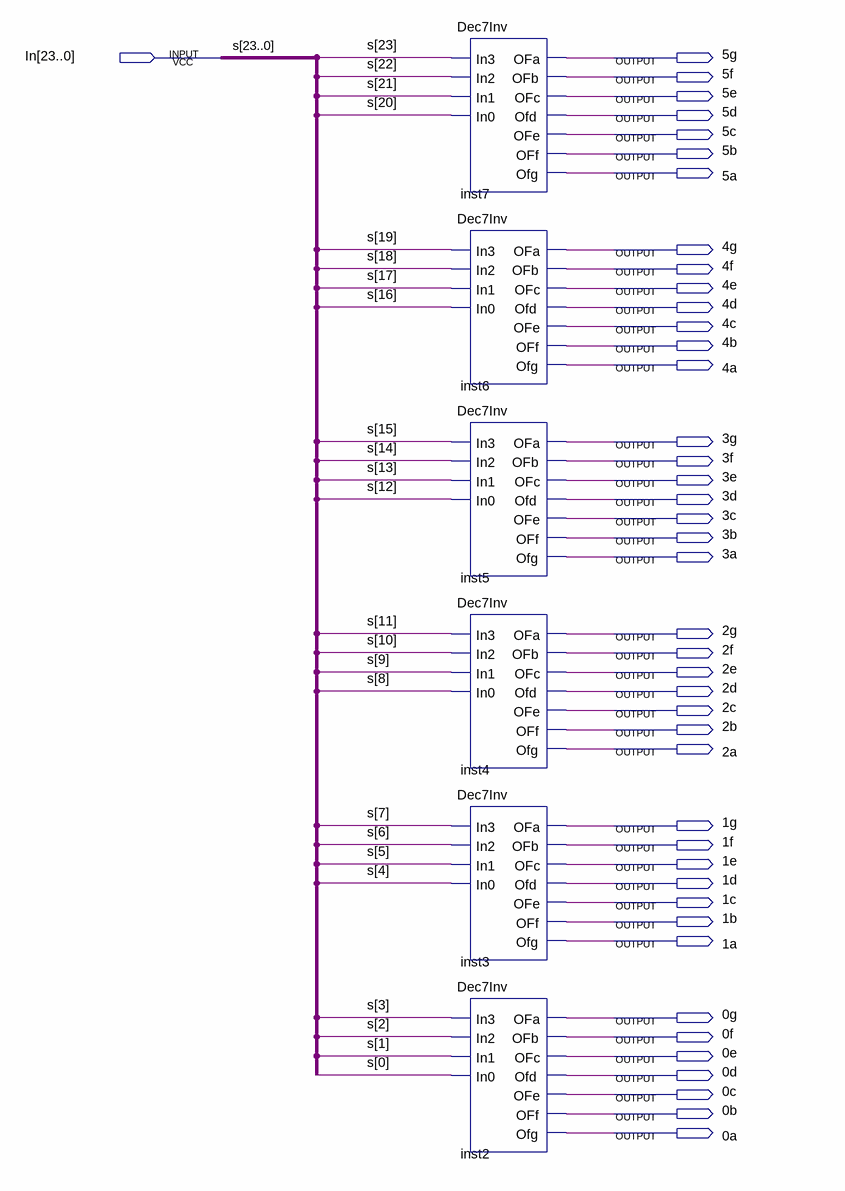
[diagram p0: schematic sheet]
// Quartus schematic Hex_0_5.bdf as structural Verilog: 6 symbols, 43 pins
module Hex_0_5 (
  input  [23:0] In,
  output \5g ,
  output \5f ,
  output \5e ,
  output \5d ,
  output \5c ,
  output \5b ,
  output \5a ,
  output \4g ,
  output \4f ,
  output \4e ,
  output \4d ,
  output \4c ,
  output \4b ,
  output \4a ,
  output \3g ,
  output \3f ,
  output \3e ,
  output \3d ,
  output \3c ,
  output \3b ,
  output \3a ,
  output \2g ,
  output \2f ,
  output \2e ,
  output \2d ,
  output \2c ,
  output \2b ,
  output \2a ,
  output \1g ,
  output \1f ,
  output \1e ,
  output \1d ,
  output \1c ,
  output \1b ,
  output \1a ,
  output \0g ,
  output \0f ,
  output \0e ,
  output \0d ,
  output \0c ,
  output \0b ,
  output \0a 
);

  Dec7Inv inst7 (
    .In3(In[23]), .In2(In[22]), .In1(In[21]), .In0(In[20]), .OFa(\5g ), .OFb(\5f ), .OFc(\5e ), .Ofd(\5d ),
    .OFe(\5c ), .OFf(\5b ), .Ofg(\5a ));
  Dec7Inv inst6 (
    .In3(In[19]), .In2(In[18]), .In1(In[17]), .In0(In[16]), .OFa(\4g ), .OFb(\4f ), .OFc(\4e ), .Ofd(\4d ),
    .OFe(\4c ), .OFf(\4b ), .Ofg(\4a ));
  Dec7Inv inst5 (
    .In3(In[15]), .In2(In[14]), .In1(In[13]), .In0(In[12]), .OFa(\3g ), .OFb(\3f ), .OFc(\3e ), .Ofd(\3d ),
    .OFe(\3c ), .OFf(\3b ), .Ofg(\3a ));
  Dec7Inv inst4 (
    .In3(In[11]), .In2(In[10]), .In1(In[9]), .In0(In[8]), .OFa(\2g ), .OFb(\2f ), .OFc(\2e ), .Ofd(\2d ),
    .OFe(\2c ), .OFf(\2b ), .Ofg(\2a ));
  Dec7Inv inst3 (
    .In3(In[7]), .In2(In[6]), .In1(In[5]), .In0(In[4]), .OFa(\1g ), .OFb(\1f ), .OFc(\1e ), .Ofd(\1d ),
    .OFe(\1c ), .OFf(\1b ), .Ofg(\1a ));
  Dec7Inv inst2 (
    .In3(In[3]), .In2(In[2]), .In1(In[1]), .In0(In[0]), .OFa(\0g ), .OFb(\0f ), .OFc(\0e ), .Ofd(\0d ),
    .OFe(\0c ), .OFf(\0b ), .Ofg(\0a ));

  // Other names for the same wires on the sheet: s[23:0] = In
endmodule
